# Altium project MIL_STD_1275D_PROTECTION.PrjPcb (part 1 of 4)
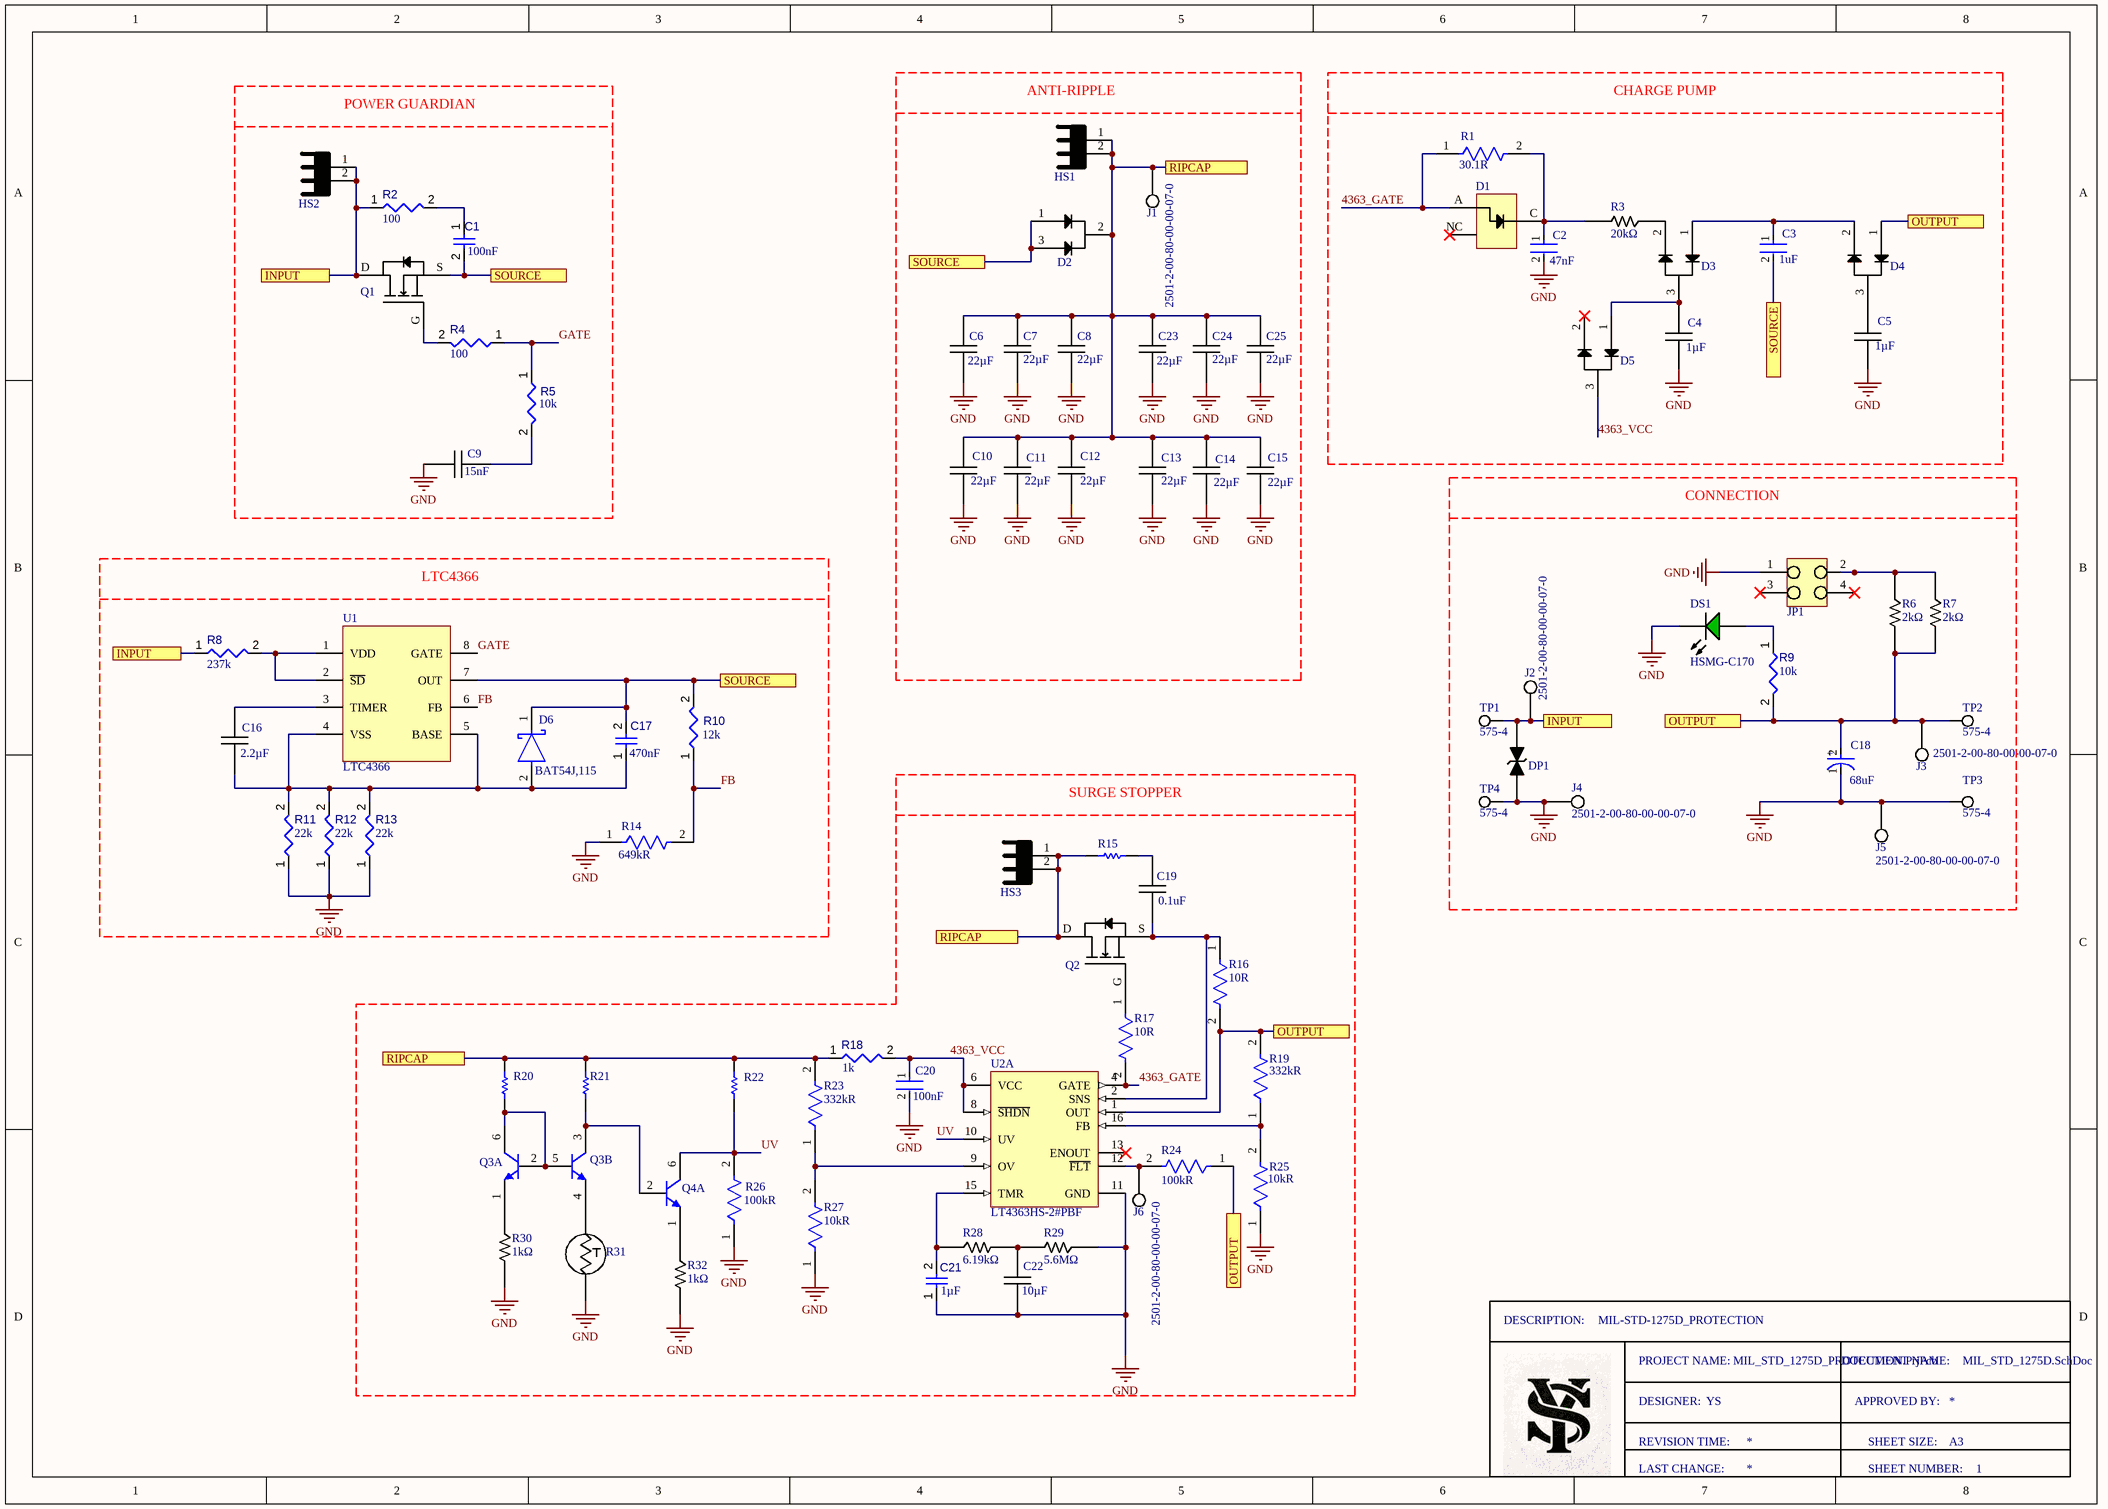
[diagram p0: MIL_STD_1275D.SchDoc]
1 sheet, 85 parts. Net scope: flat (ports and power ports of the same name join across sheets).
Board file: MIL_STD_1275D.PcbDoc

## Sheet MIL_STD_1275D.SchDoc: MIL-STD-1275D_PROTECTION
size A3; Engineer: YS; SheetNumber: 1; SheetTotal: 1

### Parts
C1  value 100nF  [CAPC0402(1005)60_L]  (hidden comment: Capacitor 100nF +/-20% 25V 0402)
C2  Capacitance: 47nF  [FP-C2012-125-0_2-IPC_B]  (hidden comment: C2012X7R2A473K125AA)
C3  Capacitance: 1uF  [FP-C5750-230-0_4-MFG]  (hidden comment: C5750X7R2E105K230KA)
C4  value 1µF  [CAP_2220]  (hidden comment: CAP_CER_2220_1uF)
C5  value 1µF  [CAP_2220]  (hidden comment: CAP_CER_2220_1uF)
C6  value 22µF  [2 J-LEAD CAP]  (hidden comment: CAP_CER__SMD_22uF)
C7  value 22µF  [2 J-LEAD CAP]  (hidden comment: CAP_CER__SMD_22uF)
C8  value 22µF  [2 J-LEAD CAP]  (hidden comment: CAP_CER__SMD_22uF)
C9  value 15nF  [CAP_1206]  (hidden comment: CAP_CER_1206_15nF)
C10  value 22µF  [2 J-LEAD CAP]  (hidden comment: CAP_CER__SMD_22uF)
C11  value 22µF  [2 J-LEAD CAP]  (hidden comment: CAP_CER__SMD_22uF)
C12  value 22µF  [2 J-LEAD CAP]  (hidden comment: CAP_CER__SMD_22uF)
C13  value 22µF  [2 J-LEAD CAP]  (hidden comment: CAP_CER__SMD_22uF)
C14  value 22µF  [2 J-LEAD CAP]  (hidden comment: CAP_CER__SMD_22uF)
C15  value 22µF  [2 J-LEAD CAP]  (hidden comment: CAP_CER__SMD_22uF)
C16  value 2.2µF  [CAP_0805]  (hidden comment: CAP_CER_0805_2.2uF)
C17  value 470nF  [CAPC0603(1608)100_L]  (hidden comment: Capacitor 470nF +/-20% 25V 0603)
C18  Capacitance: 68uF  [FP-OS-CON-SMT-F12-MFG]  (hidden comment: 50SVPF68M)
C19  value 0.1uF  [CAP_1210]  (hidden comment: CAP_CER_1210_0.1uF)
C20  Capacitance: 100nF  [FP-C2012-125-0_2-IPC_B]  (hidden comment: C2012X7R2A104K125AA)
C21  value 1µF  [CAPC1608X90X35ML15T15]  (hidden comment: Capacitor 1uF +/- 10% 16V 0603)
C22  value 10µF  [CAP_0805]  (hidden comment: CAP_CER_0805_10uF)
C23  value 22µF  [2 J-LEAD CAP]  (hidden comment: CAP_CER__SMD_22uF)
C24  value 22µF  [2 J-LEAD CAP]  (hidden comment: CAP_CER__SMD_22uF)
C25  value 22µF  [2 J-LEAD CAP]  (hidden comment: CAP_CER__SMD_22uF)
D1  DIODE_SMD_250V  [SOT_323]  (value not drawn)
D2  Rectifier Diode, 1 Phase, 2 Element  [TO-247AD]  (value not drawn)
D3  Rectifier Diode Small Signal Switching  [SOT-23]  (value not drawn)
D4  Rectifier Diode Small Signal Switching  [SOT-23]  (value not drawn)
D5  Rectifier Diode Small Signal Switching  [SOT-23]  (value not drawn)
D6  BAT54J,115  [FP-SOD323F-MFG]
DP1  TVS  [DO-214AA]  (value not drawn)
DS1  HSMG-C170  [AVAG-HSMX-C170_V]
HS1  HEAT_SINK  [HS_VERTICAL]  (value not drawn)
HS2  HEAT_SINK  [HS_VERTICAL]  (value not drawn)
HS3  HEAT_SINK  [HS_VERTICAL]  (value not drawn)
J1  2501-2-00-80-00-00-07-0  [MILMAX_2501-2-00-80-00-00-07-0]
J2  2501-2-00-80-00-00-07-0  [MILMAX_2501-2-00-80-00-00-07-0]
J3  2501-2-00-80-00-00-07-0  [MILMAX_2501-2-00-80-00-00-07-0]
J4  2501-2-00-80-00-00-07-0  [MILMAX_2501-2-00-80-00-00-07-0]
J5  2501-2-00-80-00-00-07-0  [MILMAX_2501-2-00-80-00-00-07-0]
J6  2501-2-00-80-00-00-07-0  [MILMAX_2501-2-00-80-00-00-07-0]
JP1  CONNECTOR  [CONNECTOR_NRPN022PAEN-RC]  (value not drawn)
Q1  N-CH MOSFET  [TO-3P]  (value not drawn)
Q2  N-CH MOSFET  [TO-3P]  (value not drawn)
Q3  MMDT5551-7-F  [DIOD-SOT-363-6_L]  (value not drawn)  (parts A,B of 2)
Q4  MMDT5551-7-F  [DIOD-SOT-363-6_L]  (value not drawn)  (part A of 2)
R1  Resistance: 30.1R  [FP-CRCW0805-e3-IPC_B]  (hidden comment: CRCW080530R1FKEA)
R2  value 100  [RESC0402(1005)_L]  (hidden comment: Resistor 100R +/-1 % 0402 63 mW)
R3  value 20kΩ  [RES_0805]  (hidden comment: RES_0805_20K)
R4  value 100  [RESC0402(1005)_L]  (hidden comment: Resistor 100R +/-1 % 0402 63 mW)
R5  value 10k  [RESC1005X40X25ML05T05]  (hidden comment: Resistor 10k +/-1% 0402 63 mW)
R6  value 2kΩ  [RES_2010]  (hidden comment: RES_SMD_2K_2010)
R7  value 2kΩ  [RES_2010]  (hidden comment: RES_SMD_2K_2010)
R8  value 237k  [RESC0402(1005)_L]  (hidden comment: Resistor 237K +/-1 % 0402 63 mW)
R9  value 10k  [RESC3216X60X45ML15T20]  (hidden comment: Resistor 10k +/-1% 1206 250 mW)
R10  value 12k  [RESC0402(1005)_L]  (hidden comment: 12KR2F)
R11  value 22k  [RESC0402(1005)_L]  (hidden comment: 22KR2F)
R12  value 22k  [RESC0402(1005)_L]  (hidden comment: 22KR2F)
R13  value 22k  [RESC0402(1005)_L]  (hidden comment: 22KR2F)
R14  Resistance: 649kR  [FP-CRCW1206-e3-MFG]  (hidden comment: CRCW1206649KFKEA)
R15  CRCW1210100RJNEAHP  [RESC3225X60X45NL20T20]  (value not drawn)
R16  Resistance: 10R  [FP-CRCW0805-e3-IPC_C]  (hidden comment: CRCW080510R0JNEA)
R17  Resistance: 10R  [FP-CRCW0805-e3-IPC_C]  (hidden comment: CRCW080510R0JNEA)
R18  value 1k  [RESC0402(1005)_L]  (hidden comment: 1KR2J)
R19  Resistance: 332kR  [FP-CRCW0805-e3-IPC_B]  (hidden comment: CRCW0805332KFKEA)
R20  CRCW0805301KFKEA  [RESC2013X50X30LL20T20]  (value not drawn)
R21  CRCW0805301KFKEA  [RESC2013X50X30LL20T20]  (value not drawn)
R22  CRCW0805301KFKEA  [RESC2013X50X30LL20T20]  (value not drawn)
R23  Resistance: 332kR  [FP-CRCW0805-e3-IPC_B]  (hidden comment: CRCW0805332KFKEA)
R24  Resistance: 100kR  [FP-CRCW0805-e3-MFG]  (hidden comment: CRCW0805100KFKEA)
R25  Resistance: 10kR  [FP-CRCW0805-e3-IPC_A]  (hidden comment: CRCW080510K0FKEA)
R26  Resistance: 100kR  [FP-CRCW0805-e3-MFG]  (hidden comment: CRCW0805100KFKEA)
R27  Resistance: 10kR  [FP-CRCW0805-e3-IPC_A]  (hidden comment: CRCW080510K0FKEA)
R28  value 6.19kΩ  [RES_0805]  (hidden comment: RES_0805_6.19K)
R29  value 5.6MΩ  [RES_0805]  (hidden comment: RES_0805_5.6M)
R30  value 1kΩ  [RES_0805]  (hidden comment: RES_0805_1K)
R31  THERMISTOR  [THERMISTOR]  (value not drawn)
R32  value 1kΩ  [RES_0805]  (hidden comment: RES_SMD_1K_0805)
TP1  575-4  [KSTN-575-4]
TP2  575-4  [KSTN-575-4]
TP3  575-4  [KSTN-575-4]
TP4  575-4  [KSTN-575-4]
U1  LTC4366  [TSOT_23]
U2  LT4363HS-2#PBF  [LT-S-16_N]  (part A of 2)

### Ports
INPUT (see DC2150A[1A], DC2150A[1B]), INPUT (see DC2150A[1A], DC2150A[6B]), INPUT (see DC2150A[1B], DC2150A[6B]), OUTPUT (see DC2150A[5C], DC2150A[5D], DC2150A[7B]), OUTPUT (see DC2150A[5C], DC2150A[5D], DC2150A[8A]), OUTPUT (see DC2150A[5C], DC2150A[7B], DC2150A[8A]), OUTPUT (see DC2150A[5D], DC2150A[7B], DC2150A[8A]), RIPCAP (see DC2150A[2C], DC2150A[4C]), RIPCAP (see DC2150A[2C], DC2150A[5A]), RIPCAP (see DC2150A[4C], DC2150A[5A]), SOURCE (see DC2150A[2A], DC2150A[3B], DC2150A[4A]), SOURCE (see DC2150A[2A], DC2150A[3B], DC2150A[7A]), SOURCE (see DC2150A[2A], DC2150A[4A], DC2150A[7A]), SOURCE (see DC2150A[3B], DC2150A[4A], DC2150A[7A])

### Nets
GND: C2.2 C4.2 C5.2 C6.1 C7.1 C8.1 C9.1 C10.1 C11.1 C12.1 C13.1 C14.1 C15.1 C18.1(C) C20.2 C21.1 C22.1 C23.1 C24.1 C25.1 DP1.1 DS1.2(K) J4.1 J5.1 JP1.1 R11.1 R12.1 R13.1 R14.1 R25.1 R26.1 R27.1 R29.2 R30.1 R31.1 R32.1 TP3.1 TP4.1 U2.11(GND)
4363_GATE: D1.A R1.1 R17.2 U2.4(GATE)
4363_VCC: C20.1 D5.3 R18.2 U2.6(VCC) U2.8(~{SHDN})
FB: R10.1 R14.2 U1.6(FB)
GATE: R4.1 R5.1 U1.8(GATE)
UV: Q4.6(C1) R22.1 R26.2 U2.10(UV)
NetC1_1: C1.1 R2.2
NetC1_2: C1.2 C3.2 C17.2 D2.1 D2.3 D6.1(C) Q1.S R10.2 U1.7(OUT) ; port SOURCE
NetC2_1: C2.1 D1.C R1.2 R3.1
NetC3_1: C3.1 D3.1 D4.2
NetC4_1: C4.1 D3.3 D5.1
NetC5_1: C5.1 D4.3
NetC6_2: C6.2 C7.2 C8.2 C10.2 C11.2 C12.2 C13.2 C14.2 C15.2 C23.2 C24.2 C25.2 D2.2 HS1.1 HS1.2 HS3.1 HS3.2 J1.1 Q2.D R15.1 R18.1 R20.2 R21.2 R22.2 R23.2 ; port RIPCAP
NetC9_2: C9.2 R5.2
NetC16_1: C16.1 C17.1 D6.2(A) R11.2 R12.2 R13.2 U1.4(VSS) U1.5(BASE)
NetC16_2: C16.2 U1.3(TIMER)
NetC18_2: C18.2(A) D4.1 J3.1 R6.1 R7.1 R9.2 R16.2 R19.2 R24.1 TP2.1 U2.1(OUT) ; port OUTPUT
NetC19_1: C19.1 Q2.S R16.1 U2.2(SNS)
NetC19_2: C19.2 R15.2
NetC21_2: C21.2 R28.2 U2.15(TMR)
NetC22_2: C22.2 R28.1 R29.1
NetD3_2: D3.2 R3.2
NetDP1_2: DP1.2 HS2.1 HS2.2 J2.1 Q1.D R2.1 R8.1 TP1.1 ; port INPUT
NetDS1_1: DS1.1(A) R9.1
NetJ6_1: J6.1 R24.2 U2.12(~{FLT})
NetJP1_2: JP1.2 R6.2 R7.2
NetQ1_G: Q1.G R4.2
NetQ2_G: Q2.G R17.1
NetQ3_1: Q3.1(E1) R30.2
NetQ3_2: Q3.2(B1) Q3.5(B2) Q3.6(C1) R20.1
NetQ3_3: Q3.3(C2) Q4.2(B1) R21.1
NetQ3_4: Q3.4(E2) R31.2
NetQ4_1: Q4.1(E1) R32.2
NetR8_2: R8.2 U1.1(VDD) U1.2(~{SD})
NetR19_1: R19.1 R25.2 U2.16(FB)
NetR23_1: R23.1 R27.2 U2.9(OV)

Not connected (* = marked no-connect by the designer): D1 NC*; D5 2*; JP1 3* 4*; U2 13(ENOUT)*

### Notes on the sheet
- POWER GUARDIAN
- (near HS1) ANTI-RIPPLE
- CHARGE PUMP
- CONNECTION
- LTC4366
- SURGE STOPPER
- DESCRIPTION:
- PROJECT NAME:
- DOCUMENT NAME:
- DESIGNER:
- REVISION TIME:
- APPROVED BY:
- SHEET SIZE:
- A3
- LAST CHANGE:
- SHEET NUMBER:
- (in symbol CMP-05428-000631-1) +